# Altium schematic sheet Input_Stage.SchDoc
size A3; SheetNumber: 2; SheetTotal: 3
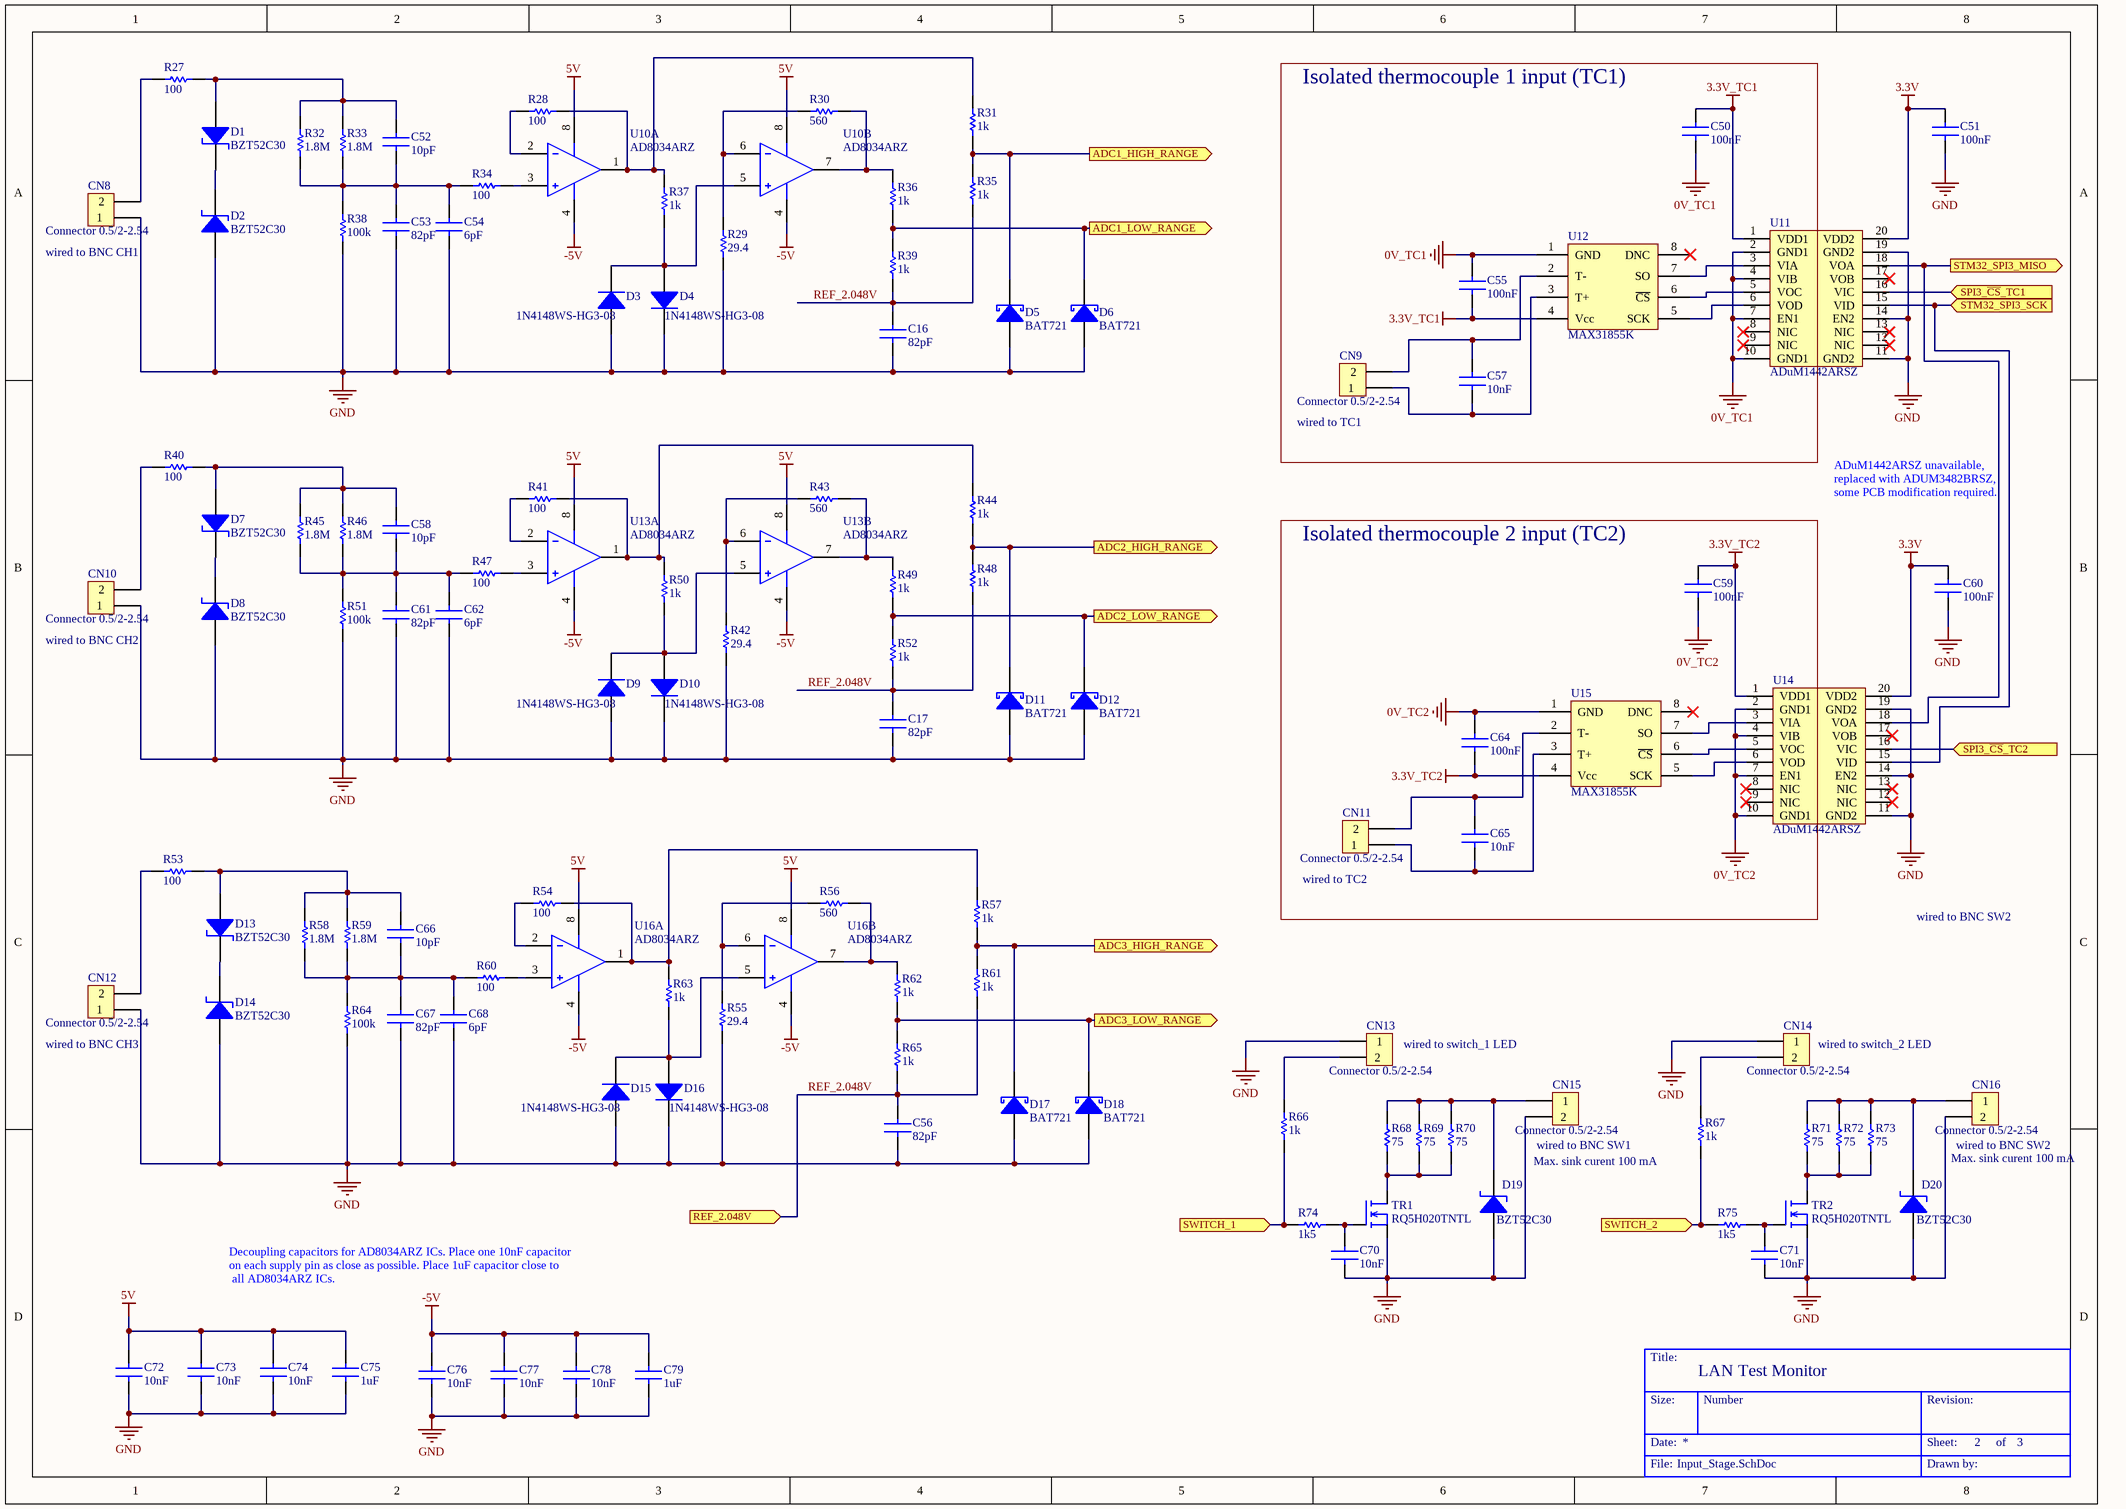
[diagram p0: Input_Stage.SchDoc]

## Parts
*  Title Block  (value not drawn)  (graphical)
C16  82pF  [Cap_0603]
C17  82pF  [Cap_0603]
C50  100nF  [Cap_0603]
C51  100nF  [Cap_0603]
C52  10pF  [Cap_0603]
C53  82pF  [Cap_0603]
C54  6pF  [Cap_0603]
C55  100nF  [Cap_0603]
C56  82pF  [Cap_0603]
C57  10nF  [Cap_0603]
C58  10pF  [Cap_0603]
C59  100nF  [Cap_0603]
C60  100nF  [Cap_0603]
C61  82pF  [Cap_0603]
C62  6pF  [Cap_0603]
C64  100nF  [Cap_0603]
C65  10nF  [Cap_0603]
C66  10pF  [Cap_0603]
C67  82pF  [Cap_0603]
C68  6pF  [Cap_0603]
C70  10nF  [Cap_0603]
C71  10nF  [Cap_0603]
C72  10nF  [Cap_0603]
C73  10nF  [Cap_0603]
C74  10nF  [Cap_0603]
C75  1uF  [Cap_0603]
C76  10nF  [Cap_0603]
C77  10nF  [Cap_0603]
C78  10nF  [Cap_0603]
C79  1uF  [Cap_0603]
CN8  Connector 0.5/2-2.54  [Connector 0.5/2-2.54]
CN9  Connector 0.5/2-2.54  [Connector 0.5/2-2.54]
CN10  Connector 0.5/2-2.54  [Connector 0.5/2-2.54]
CN11  Connector 0.5/2-2.54  [Connector 0.5/2-2.54]
CN12  Connector 0.5/2-2.54  [Connector 0.5/2-2.54]
CN13  Connector 0.5/2-2.54  [Connector 0.5/2-2.54]
CN14  Connector 0.5/2-2.54  [Connector 0.5/2-2.54]
CN15  Connector 0.5/2-2.54  [Connector 0.5/2-2.54]
CN16  Connector 0.5/2-2.54  [Connector 0.5/2-2.54]
D1  BZT52C30  [SOD123 BZT52C30]
D2  BZT52C30  [SOD123 BZT52C30]
D3  1N4148WS-HG3-08  [SOD-323 diode 1N4148WS-HG3-08]
D4  1N4148WS-HG3-08  [SOD-323 diode 1N4148WS-HG3-08]
D5  BAT721  [SOT23 BAT721]
D6  BAT721  [SOT23 BAT721]
D7  BZT52C30  [SOD123 BZT52C30]
D8  BZT52C30  [SOD123 BZT52C30]
D9  1N4148WS-HG3-08  [SOD-323 diode 1N4148WS-HG3-08]
D10  1N4148WS-HG3-08  [SOD-323 diode 1N4148WS-HG3-08]
D11  BAT721  [SOT23 BAT721]
D12  BAT721  [SOT23 BAT721]
D13  BZT52C30  [SOD123 BZT52C30]
D14  BZT52C30  [SOD123 BZT52C30]
D15  1N4148WS-HG3-08  [SOD-323 diode 1N4148WS-HG3-08]
D16  1N4148WS-HG3-08  [SOD-323 diode 1N4148WS-HG3-08]
D17  BAT721  [SOT23 BAT721]
D18  BAT721  [SOT23 BAT721]
D19  BZT52C30  [SOD123 BZT52C30]
D20  BZT52C30  [SOD123 BZT52C30]
R27  100  [Res_0603]
R28  100  [Res_0603]
R29  29.4  [Res_0603]
R30  560  [Res_0603]
R31  1k  [Res_0603]
R32  1.8M  [Res_0603]
R33  1.8M  [Res_0603]
R34  100  [Res_0603]
R35  1k  [Res_0603]
R36  1k  [Res_0603]
R37  1k  [Res_0603]
R38  100k  [Res_0603]
R39  1k  [Res_0603]
R40  100  [Res_0603]
R41  100  [Res_0603]
R42  29.4  [Res_0603]
R43  560  [Res_0603]
R44  1k  [Res_0603]
R45  1.8M  [Res_0603]
R46  1.8M  [Res_0603]
R47  100  [Res_0603]
R48  1k  [Res_0603]
R49  1k  [Res_0603]
R50  1k  [Res_0603]
R51  100k  [Res_0603]
R52  1k  [Res_0603]
R53  100  [Res_0603]
R54  100  [Res_0603]
R55  29.4  [Res_0603]
R56  560  [Res_0603]
R57  1k  [Res_0603]
R58  1.8M  [Res_0603]
R59  1.8M  [Res_0603]
R60  100  [Res_0603]
R61  1k  [Res_0603]
R62  1k  [Res_0603]
R63  1k  [Res_0603]
R64  100k  [Res_0603]
R65  1k  [Res_0603]
R66  1k  [Res_0603]
R67  1k  [Res_0603]
R68  75  [Res_0603]
R69  75  [Res_0603]
R70  75  [Res_0603]
R71  75  [Res_0603]
R72  75  [Res_0603]
R73  75  [Res_0603]
R74  1k5  [Res_0603]
R75  1k5  [Res_0603]
TR1  RQ5H020TNTL  [SOT-346-3 RQ5H020TN]
TR2  RQ5H020TNTL  [SOT-346-3 RQ5H020TN]
U10  AD8034ARZ  [8-SOIC_N AD8034ARZ]  (parts A,B of 2)
U11  ADuM1442ARSZ  [SSOP ADuM1442ARSZ]
U12  MAX31855K  [SOIC127P600X175-8N]
U13  AD8034ARZ  [8-SOIC_N AD8034ARZ]  (parts A,B of 2)
U14  ADuM1442ARSZ  [SSOP ADuM1442ARSZ]
U15  MAX31855K  [SOIC127P600X175-8N]
U16  AD8034ARZ  [8-SOIC_N AD8034ARZ]  (parts A,B of 2)

## Blocks framed on the sheet
Isolated thermocouple 1 input (TC1): C50 C55 C57 CN9 U11 U12
Isolated thermocouple 2 input (TC2): C59 C64 C65 CN11 U15

## Ports
ADC1_HIGH_RANGE (out), ADC1_LOW_RANGE (out), ADC2_HIGH_RANGE (out), ADC2_LOW_RANGE (out), ADC3_HIGH_RANGE (out), ADC3_LOW_RANGE (out), REF_2.048V (in), SPI3_~{CS}_TC1 (in), SPI3_~{CS}_TC2 (in), STM32_SPI3_MISO (out), STM32_SPI3_SCK (in), SWITCH_1 (in), SWITCH_2 (in)

## Nets
0V_TC1: C50.1 C55.2 U11.2(GND1) U11.4(VIB) U11.7(EN1) U11.10(GND1) U12.1(GND)
0V_TC2: C59.1 C64.2 U14.2(GND1) U14.4(VIB) U14.7(EN1) U14.10(GND1) U15.1(GND)
3.3V: C51.2 C60.2 U11.20(VDD2) U14.20(VDD2)
3.3V_TC1: C50.2 C55.1 U11.1(VDD1) U12.4(Vcc)
3.3V_TC2: C59.2 C64.1 U14.1(VDD1) U15.4(Vcc)
5V: C72.2 C73.2 C74.2 C75.2 U10.8(V+) U13.8(V+) U16.8(V+)
-5V: C76.2 C77.2 C78.2 C79.2 U10.4(V-) U13.4(V-) U16.4(V-)
GND: C16.1 C17.1 C51.1 C53.1 C54.1 C56.1 C60.1 C61.1 C62.1 C67.1 C68.1 C70.2 C71.2 C72.1 C73.1 C74.1 C75.1 C76.1 C77.1 C78.1 C79.1 CN8.1 CN10.1 CN12.1 CN13.1 CN14.1 CN15.2 CN16.2 D2.1(A) D3.1(A) D4.2(K) D5.1(A) D6.1(A) D8.1(A) D9.1(A) D10.2(K) D11.1(A) D12.1(A) D14.1(A) D15.1(A) D16.2(K) D17.1(A) D18.1(A) D19.1(A) D20.1(A) R29.1 R38.1 R42.1 R51.1 R55.1 R64.1 TR1.3 TR2.3 U11.11(GND2) U11.14(EN2) U11.19(GND2) U14.11(GND2) U14.14(EN2) U14.19(GND2)
ADC1_HIGH_RANGE: D5.2(K) R31.2 R35.1 ; port ADC1_HIGH_RANGE
ADC1_LOW_RANGE: D6.2(K) R36.2 R39.1 ; port ADC1_LOW_RANGE
ADC2_HIGH_RANGE: D11.2(K) R44.2 R48.1 ; port ADC2_HIGH_RANGE
ADC2_LOW_RANGE: D12.2(K) R49.2 R52.1 ; port ADC2_LOW_RANGE
ADC3_HIGH_RANGE: D17.2(K) R57.2 R61.1 ; port ADC3_HIGH_RANGE
ADC3_LOW_RANGE: D18.2(K) R62.2 R65.1 ; port ADC3_LOW_RANGE
REF_2.048V: C16.2 C17.2 C56.2 R35.2 R39.2 R48.2 R52.2 R61.2 R65.2 ; port REF_2.048V
SPI3_~{CS}_TC1: U11.16(VIC) ; port SPI3_~{CS}_TC1
SPI3_~{CS}_TC2: U14.16(VIC) ; port SPI3_~{CS}_TC2
STM32_SPI3_MISO: U11.18(VOA) U14.18(VOA) ; port STM32_SPI3_MISO
STM32_SPI3_SCK: U11.15(VID) U14.15(VID) ; port STM32_SPI3_SCK
SWITCH_1: R66.1 R74.1 ; port SWITCH_1
SWITCH_2: R67.1 R75.1 ; port SWITCH_2
NetC52_1: C52.1 C53.2 C54.2 R32.1 R33.1 R34.1 R38.2
NetC52_2: C52.2 D1.1(A) R27.2 R32.2 R33.2
NetC57_1: C57.1 CN9.1 U12.3(T+)
NetC57_2: C57.2 CN9.2 U12.2(T-)
NetC58_1: C58.1 C61.2 C62.2 R45.1 R46.1 R47.1 R51.2
NetC58_2: C58.2 D7.1(A) R40.2 R45.2 R46.2
NetC65_1: C65.1 CN11.1 U15.3(T+)
NetC65_2: C65.2 CN11.2 U15.2(T-)
NetC66_1: C66.1 C67.2 C68.2 R58.1 R59.1 R60.1 R64.2
NetC66_2: C66.2 D13.1(A) R53.2 R58.2 R59.2
NetC70_1: C70.1 R74.2 TR1.1
NetC71_1: C71.1 R75.2 TR2.1
NetCN8_2: CN8.2 R27.1
NetCN10_2: CN10.2 R40.1
NetCN12_2: CN12.2 R53.1
NetCN13_2: CN13.2 R66.2
NetCN14_2: CN14.2 R67.2
NetCN15_1: CN15.1 D19.2(K) R68.2 R69.2 R70.2
NetCN16_1: CN16.1 D20.2(K) R71.2 R72.2 R73.2
NetD1_2: D1.2(K) D2.2(K)
NetD3_2: D3.2(K) D4.1(A) R37.1 U10.5(+IN2)
NetD7_2: D7.2(K) D8.2(K)
NetD9_2: D9.2(K) D10.1(A) R50.1 U13.5(+IN2)
NetD13_2: D13.2(K) D14.2(K)
NetD15_2: D15.2(K) D16.1(A) R63.1 U16.5(+IN2)
NetR28_1: R28.1 U10.2(-IN1)
NetR28_2: R28.2 R31.1 R37.2 U10.1(OUT1)
NetR29_2: R29.2 R30.1 U10.6(-IN2)
NetR30_2: R30.2 R36.1 U10.7(OUT1)
NetR34_2: R34.2 U10.3(+IN1)
NetR41_1: R41.1 U13.2(-IN1)
NetR41_2: R41.2 R44.1 R50.2 U13.1(OUT1)
NetR42_2: R42.2 R43.1 U13.6(-IN2)
NetR43_2: R43.2 R49.1 U13.7(OUT1)
NetR47_2: R47.2 U13.3(+IN1)
NetR54_1: R54.1 U16.2(-IN1)
NetR54_2: R54.2 R57.1 R63.2 U16.1(OUT1)
NetR55_2: R55.2 R56.1 U16.6(-IN2)
NetR56_2: R56.2 R62.1 U16.7(OUT1)
NetR60_2: R60.2 U16.3(+IN1)
NetR68_1: R68.1 R69.1 R70.1 TR1.2
NetR71_1: R71.1 R72.1 R73.1 TR2.2
NetU11_3: U11.3(VIA) U12.7(SO)
NetU11_5: U11.5(VOC) U12.6(~{CS})
NetU11_6: U11.6(VOD) U12.5(SCK)
NetU14_3: U14.3(VIA) U15.7(SO)
NetU14_5: U14.5(VOC) U15.6(~{CS})
NetU14_6: U14.6(VOD) U15.5(SCK)

Not connected (* = marked no-connect by the designer): U11 8(NIC)* 9(NIC)* 12(NIC)* 13(NIC)* 17(VOB)*; U12 8(DNC)*; U14 8(NIC)* 9(NIC)* 12(NIC)* 13(NIC)* 17(VOB)*; U15 8(DNC)*

## Notes on the sheet
- (near CN8) wired to BNC CH1
- (near CN9) wired to TC1
- ADuM1442ARSZ unavailable,
  replaced with ADUM3482BRSZ,
  some PCB modification required.
- (near CN10) wired to BNC CH2
- (near CN11) wired to TC2
- wired to BNC SW2
- (near CN12) wired to BNC CH3
- wired to switch_1 LED
- wired to switch_2 LED
- Max. sink curent 100 mA
- (near CN15) wired to BNC SW1
- (near CN16) wired to BNC SW2
- Decoupling capacitors for AD8034ARZ ICs. Place one 10nF capacitor
  on each supply pin as close as possible. Place 1uF capacitor close to
  all AD8034ARZ ICs.
- (in symbol Title Block) Title:; LAN Test Monitor; Size:; Number; Revision:; Date:; Sheet:; of; File:; Drawn by:

## Library data of the parts
C16 C17 C53 C56 C61 C67 = Cap 82pF 0603 10%
C50 C51 C55 C59 C60 C64 = Cap 100nF 0603 10%
C52 C58 C66 = Cap 10pF 0603 10%
C54 C62 C68 = Cap 6pF 0603 10%
C57 C65 C70-C74 C76-C78 = Cap 10nF 0603 10%
C75 C79 = Cap 1uF 0603 10%
CN8-CN16 = Phoenix Contact MPT 0.5/2-2.54
D1 D2 D7 D8 D13 D14 D19 D20 = zener diode BZT52C30: Zener Diode; Published: 8-Jun-2000; LatestRevisionDate: 17-Jul-2002; LatestRevisionNote: Re-released for DXP Platform.; PackageReference: DIODE-0.7; Publisher: Altium Limited; PackageDescription: Diode, Thru-Hole; 2 Leads; 0.7 in Pin Spacing
D3 D4 D9 D10 D15 D16 = Diode 1N4148WS-HG3-08: Published: 8-Jun-2000; LatestRevisionDate: 17-Jul-2002; LatestRevisionNote: Re-released for DXP Platform.; PackageVersion: Sep-1996; PackageReference: SMC; Publisher: Altium Limited; PackageDescription: DO-214-AB/SMC; 2 C-Bend Leads; Body 7.9 x 5.9 mm, inc. leads (LxW); Code_JEDEC: DO-214-AB
D5 D6 D11 D12 D17 D18 = Diode BAT721: Schottky diode BAT721; Published: 8-Jun-2000; LatestRevisionDate: 17-Jul-2002; LatestRevisionNote: Re-released for DXP Platform.; PackageVersion: Sep-1996; PackageReference: SMC; Publisher: Altium Limited; PackageDescription: DO-214-AB/SMC; 2 C-Bend Leads; Body 7.9 x 5.9 mm, inc. leads (LxW); Code_JEDEC: DO-214-AB
R27 R28 R34 R40 R41 R47 R53 R54 R60 = Res 100 1% 0603: Manuf_Part_1: MCT 0603-50 1% P5 12K1; Manuf_1: VISHAY; Value: 12K1; Order: 2325243; ECCN_US/EU: n/a; Distrib: FARNELL
R29 R42 R55 = Res 29.4 1% 0603: Manuf_Part_1: MCT 0603-50 1% P5 12K1; Manuf_1: VISHAY; Value: 12K1; Order: 2325243; ECCN_US/EU: n/a; Distrib: FARNELL
R30 R43 R56 = Res 560 1% 0603: Manuf_Part_1: MCT 0603-50 1% P5 12K1; Manuf_1: VISHAY; Value: 12K1; Order: 2325243; ECCN_US/EU: n/a; Distrib: FARNELL
R31 R35-R37 R39 R44 R48-R50 R52 R57 R61-R63 R65-R67 = Res 1k 1% 0603: Manuf_Part_1: MCT 0603-50 1% P5 12K1; Manuf_1: VISHAY; Value: 12K1; Order: 2325243; ECCN_US/EU: n/a; Distrib: FARNELL
R32 R33 R45 R46 R58 R59 = Res 1.8M 1% 0603: Manuf_Part_1: MCT 0603-50 1% P5 12K1; Manuf_1: VISHAY; Value: 12K1; Order: 2325243; ECCN_US/EU: n/a; Distrib: FARNELL
R38 R51 R64 = Res 100k 1% 0603: Manuf_Part_1: MCT 0603-50 1% P5 12K1; Manuf_1: VISHAY; Value: 12K1; Order: 2325243; ECCN_US/EU: n/a; Distrib: FARNELL
R68-R73 = Res 75 1% 0603: Manuf_Part_1: MCT 0603-50 1% P5 12K1; Manuf_1: VISHAY; Value: 12K1; Order: 2325243; ECCN_US/EU: n/a; Distrib: FARNELL
R74 R75 = Res 1k5 1% 0603: Manuf_Part_1: MCT 0603-50 1% P5 12K1; Manuf_1: VISHAY; Value: 12K1; Order: 2325243; ECCN_US/EU: n/a; Distrib: FARNELL
TR1 TR2 = RQ5H020TNTL: MOSFET N-CH 60V 2A 500mW
U10 U13 U16 = AD8034ARZ: dual op amp; Published: 8-Jun-2000; LatestRevisionDate: 17-Jul-2002; LatestRevisionNote: Re-released for DXP Platform.; DatasheetVersion: REV. B; PackageVersion: 1990; PackageReference: H-08A; Publisher: Altium Limited; PackageDescription: Can; 8 Leads; Pin Circle Dia. 5.08 mm; Lead Dia. 0.53 mm (max); ComponentLink1Description: Manufacturer Link; ComponentLink1URL: http://www.analog.com/
U11 U14 = ADuM1442ARSZ: ADuM1442ARSZ isolator; Manuf_Part_1: MCT 0603-50 1% P5 12K1; Manuf_1: VISHAY; Value: 12K1; Order: 2325243; ECCN_US/EU: n/a; Distrib: FARNELL
U12 U15 = MAX31855K: Thermocouple to digital converter